# Altium project PCB_Project.PrjPcb
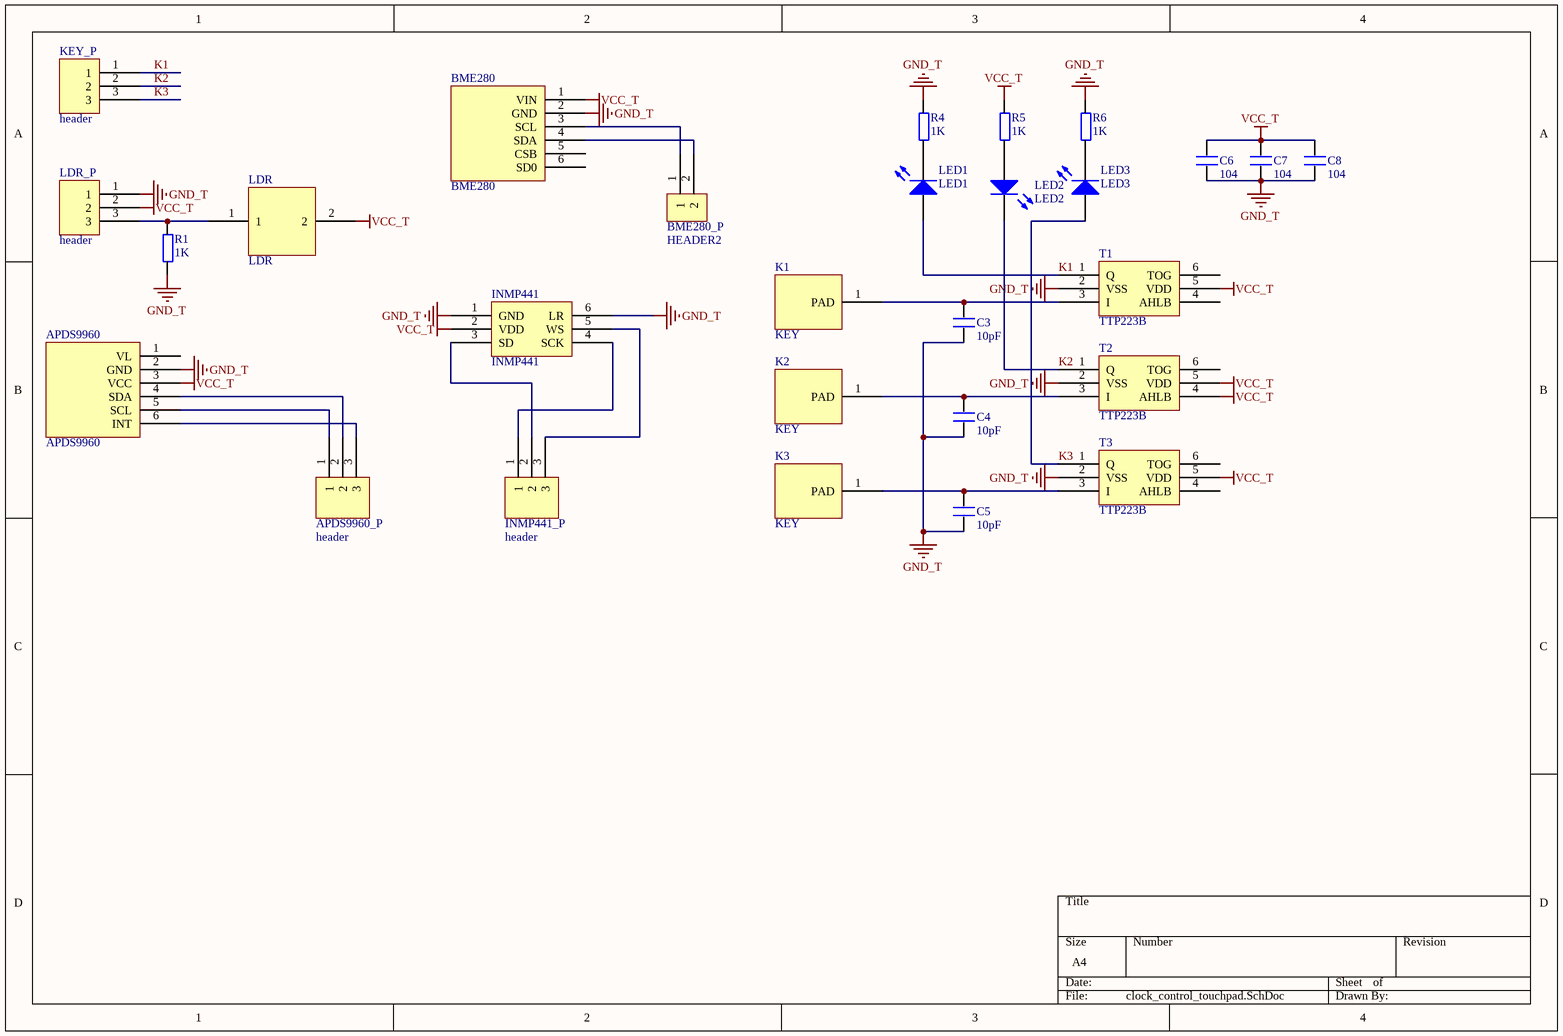
[diagram p0: clock_control_touchpad.SchDoc]
2 sheets, 48 parts. Net scope: global (net labels, ports and power ports of the same name join across sheets).
Board file: clock_control.PcbDoc
Sheets:
  clock_control_touchpad.SchDoc
  clock_control.SchDoc

## Sheet clock_control_touchpad.SchDoc
size A4

### Parts
(Parts that share a designator on the sheet are numbered #1, #2 ... from top to bottom, then left to right.)
APDS9960#1  APDS9960  [APDS-9960]
APDS9960_P  header  [HEADER3-2.0]
BME280#1  BME280  [BME280]
BME280_P  HEADER2  [HEADER2-2.0]
C3  10pF  [0603P]
C4  10pF  [0603P]
C5  10pF  [0603P]
C6  104  [0603P]
C7  104  [0603P]
C8  104  [0603P]
INMP441#1  INMP441  [INMP441]
INMP441_P  header  [HEADER3-2.0]
K1  KEY  [TOUCH-PAD]
K2  KEY  [TOUCH-PAD]
K3  KEY  [TOUCH-PAD]
KEY_P  header  [HEADER3-2.0]
LDR#1  LDR  [LDR]
LDR_P  header  [HEADER3-2.0]
LED1  LED1  [LED]
LED2  LED2  [LED]
LED3  LED3  [LED]
R1  1K  [0603P]
R4  1K  [0603P]
R5  1K  [0603P]
R6  1K  [0603P]
T1  TTP223B  [TTP223B]
T2  TTP223B  [TTP223B]
T3  TTP223B  [TTP223B]

### Nets
GND_T: APDS9960#1.2(GND) BME280#1.2(GND) C3.1 C4.1 C5.1 C6.1 C7.1 C8.1 INMP441#1.1(GND) INMP441#1.6(LR) LDR_P.1 R1.1 R4.2 R6.2 T1.2(VSS) T2.2(VSS) T3.2(VSS)
VCC_T: APDS9960#1.3(VCC) BME280#1.1(VIN) C6.2 C7.2 C8.2 INMP441#1.2(VDD) LDR#1.2 LDR_P.2 R5.2 T1.5(VDD) T2.4(AHLB) T2.5(VDD) T3.5(VDD)
K1: KEY_P.1 LED1.1(A) T1.1(Q)
K2: KEY_P.2 LED2.2(K) T2.1(Q)
K3: KEY_P.3 LED3.1(A) T3.1(Q)
NetAPDS9960#1_4: APDS9960#1.4(SDA) APDS9960_P.2
NetAPDS9960#1_5: APDS9960#1.5(SCL) APDS9960_P.1
NetAPDS9960#1_6: APDS9960#1.6(INT) APDS9960_P.3
NetBME280#1_3: BME280#1.3(SCL) BME280_P.1
NetBME280#1_4: BME280#1.4(SDA) BME280_P.2
NetC3_2: C3.2 K1.1(PAD) T1.3(I)
NetC4_2: C4.2 K2.1(PAD) T2.3(I)
NetC5_2: C5.2 K3.1(PAD) T3.3(I)
NetINMP441#1_3: INMP441#1.3(SD) INMP441_P.2
NetINMP441#1_4: INMP441#1.4(SCK) INMP441_P.1
NetINMP441#1_5: INMP441#1.5(WS) INMP441_P.3
NetLDR#1_1: LDR#1.1 LDR_P.3 R1.2
NetLED1_2: LED1.2(K) R4.1
NetLED2_1: LED2.1(A) R5.1
NetLED3_2: LED3.2(K) R6.1

Not connected (* = marked no-connect by the designer): APDS9960#1 1(VL); BME280#1 5(CSB) 6(SD0); T1 4(AHLB) 6(TOG); T2 6(TOG); T3 4(AHLB) 6(TOG)

### Library data of the parts
APDS9960_P INMP441_P KEY_P LDR_P = HEADER3
C3-C8 = C
K1-K3 = TOUCH-PAD
LED1-LED3 = LED2: Typical RED, GREEN, YELLOW, AMBER GaAs LED; Published: 8-Jun-2000; LatestRevisionDate: 17-Jul-2002; LatestRevisionNote: Re-released for DXP Platform.; PackageVersion: Feb-2002; PackageReference: 3.2X1.6X1.1; Publisher: Altium Limited; PackageDescription: SM LED; 2 Flat Leads
R1 R4-R6 = R

## Sheet clock_control.SchDoc
size A4
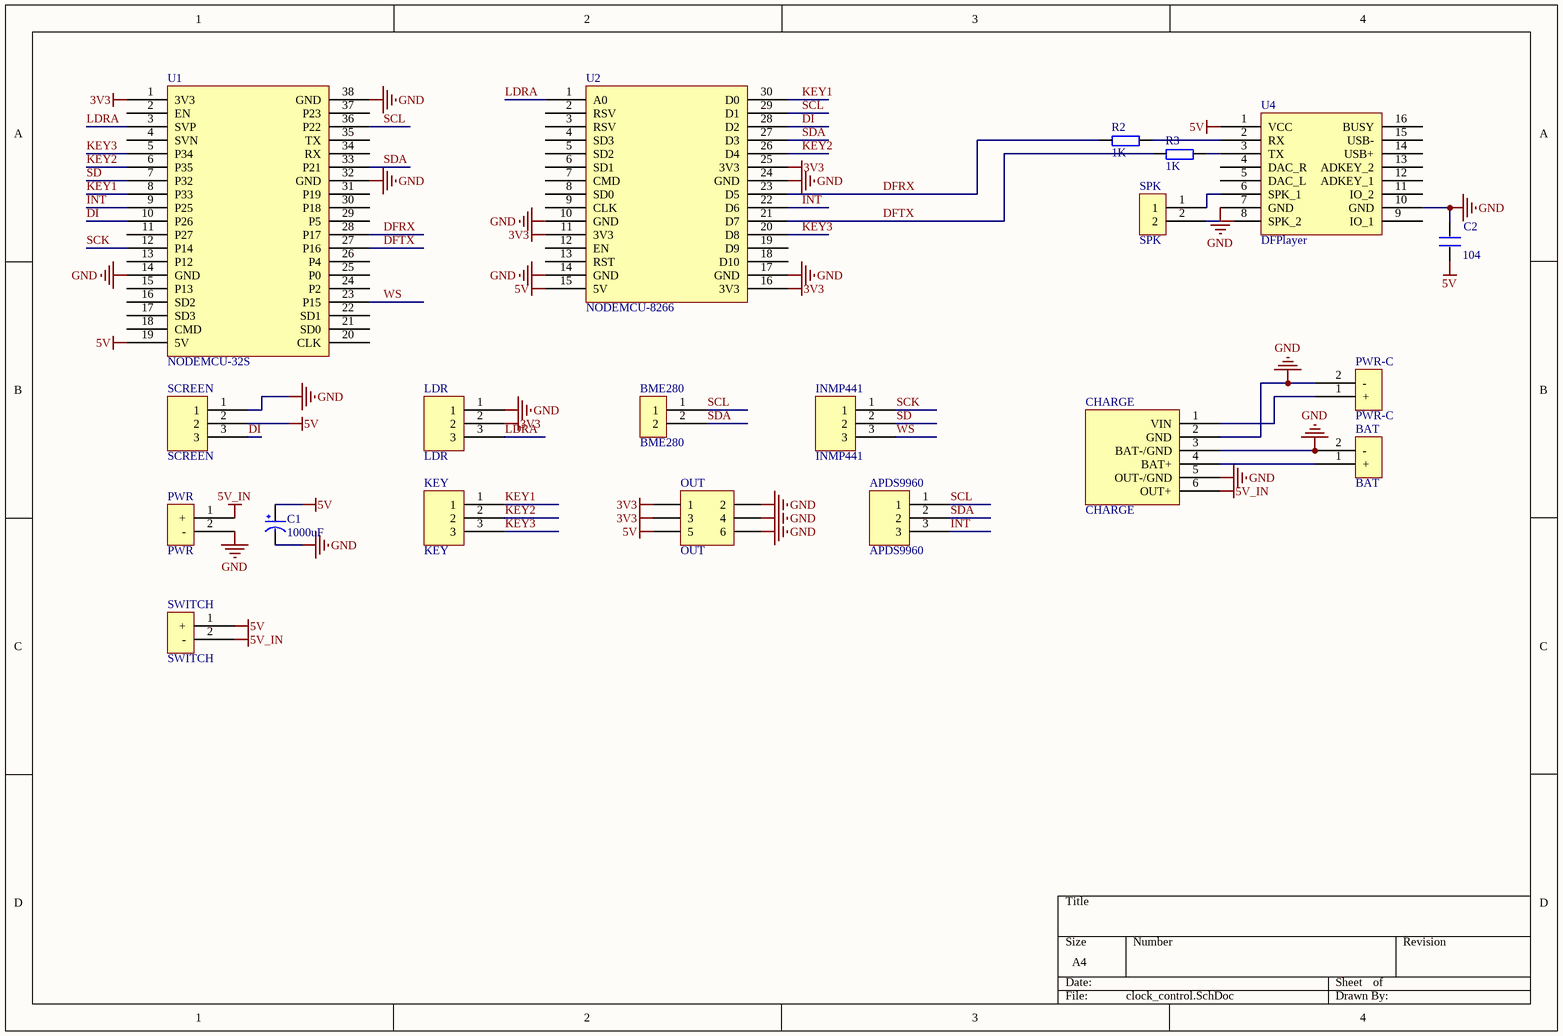
[diagram p1: clock_control.SchDoc]

### Parts
(Parts that share a designator on the sheet are numbered #1, #2 ... from top to bottom, then left to right.)
APDS9960#2  APDS9960  [HEADER3-P]
BAT  BAT  [HEADER2-P]
BME280#2  BME280  [HEADER2-P]
C1  1000uF  [C0812]
C2  104  [0603P]
CHARGE  CHARGE  [CHARGE]
INMP441#2  INMP441  [HEADER3-P]
KEY  KEY  [HEADER3-P]
LDR#2  LDR  [HEADER3-P]
OUT  OUT  [HDR2X3]
PWR  PWR  [HEADER2-P]
PWR-C  PWR-C  [HEADER2-P]
R2  1K  [0603P]
R3  1K  [0603P]
SCREEN  SCREEN  [HEADER3-P]
SPK  SPK  [HEADER2-P]
SWITCH  SWITCH  [HEADER2-P]
U1  NODEMCU-32S  [NODEMCU-32S-2P]
U2  NODEMCU-8266  [NODEMCU-8266-2P]
U4  DFPlayer  [DFPlayer]

### Nets
3V3: LDR#2.2 OUT.1 OUT.3 U1.1(3V3) U2.11(3V3) U2.16(3V3) U2.25(3V3)
5V: C1.1(VCC) C2.1 OUT.5 SCREEN.2 SWITCH.1(+) U1.19(5V) U2.15(5V) U4.1(VCC)
5V_IN: CHARGE.6(OUT+) PWR.1(+) SWITCH.2(-)
GND: BAT.2(-) C1.2(GND) C2.2 CHARGE.2(GND) CHARGE.3(BAT-/GND) CHARGE.5(OUT-/GND) LDR#2.1 OUT.2 OUT.4 OUT.6 PWR.2(-) PWR-C.2(-) SCREEN.1 U1.14(GND) U1.32(GND) U1.38(GND) U2.10(GND) U2.14(GND) U2.17(GND) U2.24(GND) U4.7(GND) U4.10(GND)
DFRX: R2.1 U1.28(P17) U2.23(D5)
DFTX: R3.1 U1.27(P16) U2.21(D7)
DI: SCREEN.3 U1.10(P26) U2.28(D2)
INT: APDS9960#2.3 U1.9(P25) U2.22(D6)
KEY1: KEY.1 U1.8(P33) U2.30(D0)
KEY2: KEY.2 U1.6(P35) U2.26(D4)
KEY3: KEY.3 U1.5(P34) U2.20(D8)
LDRA: LDR#2.3 U1.3(SVP) U2.1(A0)
SCK: INMP441#2.1 U1.12(P14)
SCL: APDS9960#2.1 BME280#2.1 U1.36(P22) U2.29(D1)
SD: INMP441#2.2 U1.7(P32)
SDA: APDS9960#2.2 BME280#2.2 U1.33(P21) U2.27(D3)
WS: INMP441#2.3 U1.23(P15)
NetBAT_1: BAT.1(+) CHARGE.4(BAT+)
NetCHARGE_1: CHARGE.1(VIN) PWR-C.1(+)
NetR2_2: R2.2 U4.2(RX)
NetR3_2: R3.2 U4.3(TX)
NetSPK_1: SPK.1 U4.6(SPK_1)
NetSPK_2: SPK.2 U4.8(SPK_2)

Not connected (* = marked no-connect by the designer): U1 2(EN) 4(SVN) 11(P27) 13(P12) 15(P13) 16(SD2) 17(SD3) 18(CMD) 20(CLK) 21(SD0) 22(SD1) 24(P2) 25(P0) 26(P4) 29(P5) 30(P18) 31(P19) 34(RX) 35(TX) 37(P23); U2 2(RSV) 3(RSV) 4(SD3) 5(SD2) 6(SD1) 7(CMD) 8(SD0) 9(CLK) 12(EN) 13(RST) 18(D10) 19(D9); U4 4(DAC_R) 5(DAC_L) 9(IO_1) 11(IO_2) 12(ADKEY_1) 13(ADKEY_2) 14(USB+) 15(USB-) 16(BUSY)

### Library data of the parts
APDS9960#2 INMP441#2 KEY LDR#2 SCREEN = HEADER3
BAT PWR PWR-C SWITCH = HEADER2-PWR
BME280#2 SPK = HEADER2
C1 = CAP
C2 = C
OUT = Header 3X2: Header, 3-Pin, Dual row; LatestRevisionDate: 17-Jul-2002; LatestRevisionNote: Re-released for DXP Platform.; Publisher: Altium Limited
R2 R3 = R